# Altium schematic sheet COVER PAGE.SchDoc: ETHERNET SWITCH LAYER 2
size A3; DrawnBy: Luca Schenetti; Revision: C; SheetNumber: 1; SheetTotal: 5; Material: JLC04161H-3313
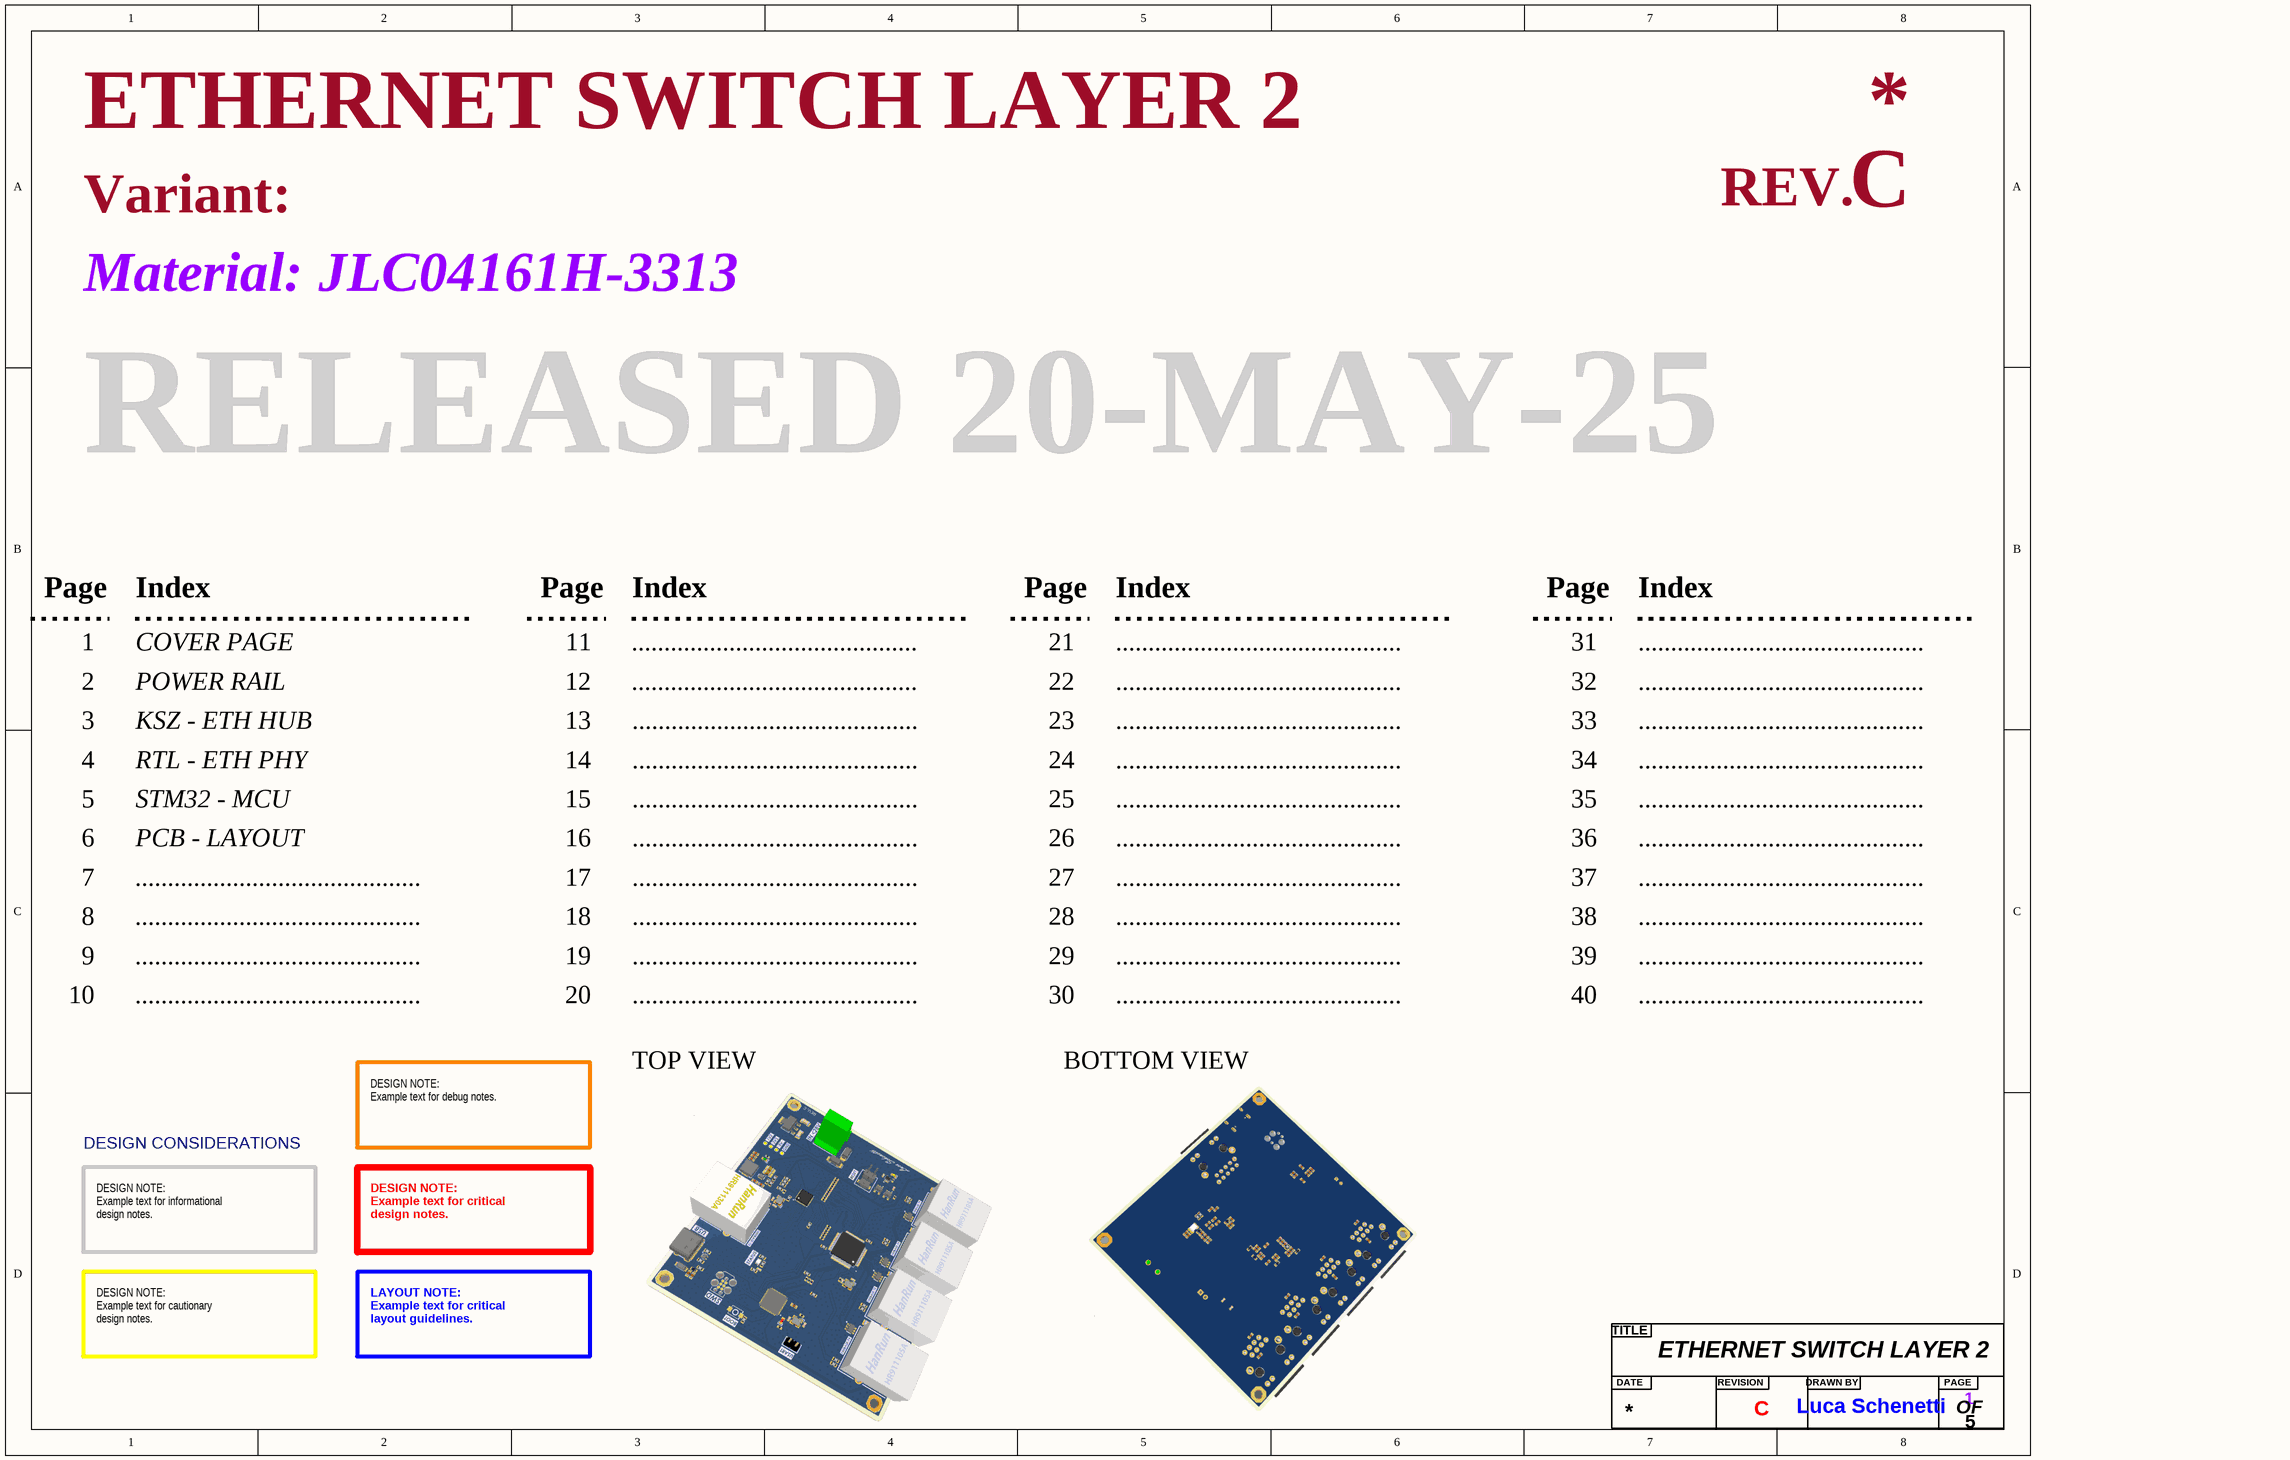
[diagram p0: COVER PAGE.SchDoc]

## Parts
?  Title  (value not drawn)  (graphical)

## Notes on the sheet
- Variant:
- REV.
- Material:
- RELEASED 20-MAY-25
- Page
- Index
- 1
- 2
- COVER PAGE
- POWER RAIL
- 11
- 12
- ............................................
- 21
- 22
- 31
- 32
- 3
- KSZ - ETH HUB
- 13
- 23
- 33
- 4
- 5
- RTL - ETH PHY
- STM32 - MCU
- 14
- 15
- 24
- 25
- 34
- 35
- 6
- 7
- PCB - LAYOUT
- 16
- 17
- 26
- 27
- 36
- 37
- 8
- 18
- 28
- 38
- 9
- 10
- 19
- 20
- 29
- 30
- 39
- 40
- TOP VIEW
- BOTTOM VIEW
- DESIGN CONSIDERATIONS
- DESIGN NOTE:
  Example text for debug notes.
- DESIGN NOTE:
  Example text for informational
  design notes.
- DESIGN NOTE:
  Example text for critical
  design notes.
- DESIGN NOTE:
  Example text for cautionary
  design notes.
- LAYOUT NOTE:
  Example text for critical
  layout guidelines.
- (in symbol Title) TITLE; DATE; REVISION; DRAWN BY; PAGE; OF